# Altium schematic sheet 2014-09-02_06-17-421.schdoc
size 201 x 124 mm; SheetNumber: 1; SheetTotal: 1
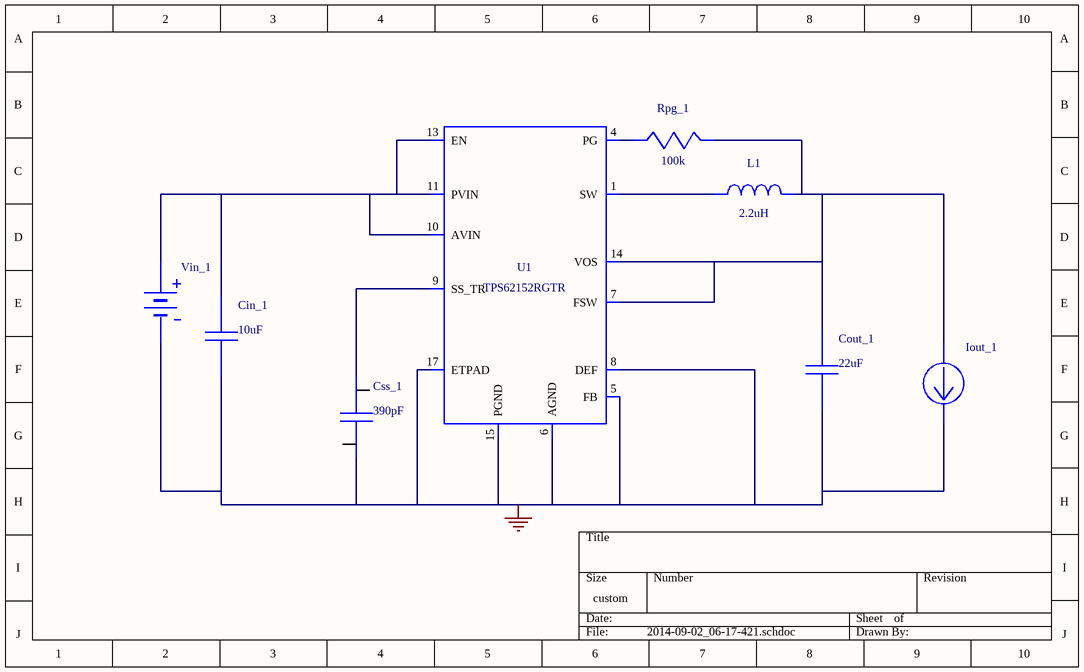
[diagram p0: 2014-09-02_06-17-421.schdoc]

## Parts
Cin_1  value 10uF  (hidden comment: CL10A106MQ8NNNC)
Cout_1  value 22uF  (hidden comment: C2012X5R0J226M)
Css_1  value 390pF  (hidden comment: GRM033R71C391KA01D)
Iout_1  WB_CURRENT_LOAD  (value not drawn)
L1  value 2.2uH  (hidden comment: SDR0403-2R2ML)
Rpg_1  value 100k  (hidden comment: CRCW0402100KFKED)
U1  TPS62131RGTR  (value not drawn)
Vin_1  WB_BATTERY  (value not drawn)

## Nets
0: Cin_1.2 Cout_1.2 Iout_1.2(-) U1.5(FB) U1.6(AGND) U1.8(DEF) U1.15(PGND) U1.16(PGND) U1.17(ETPAD) Vin_1.2(-)
NetCin_1_1: Cin_1.1 U1.10(AVIN) U1.11(PVIN) U1.12(PVIN) U1.13(EN) Vin_1.1(+)
NetCout_1_1: Cout_1.1 Iout_1.1(+) L1.1 Rpg_1.1 U1.7(FSW) U1.14(VOS)
NetL1_2: L1.2 U1.1(SW) U1.2(SW) U1.3(SW)
NetRpg_1_2: Rpg_1.2 U1.4(PG)

Not connected (* = marked no-connect by the designer): Css_1 1 2; U1 9(SS_TR)

## Library data of the parts
Cin_1 = CL10A106MQ8NNNC: Manufacturer Name: Samsung Electro-Mechanics; PackageReference: CL10A106MQ8NNNC; Manufacturer Part Number: CL10A106MQ8NNNC
Cout_1 = C2012X5R0J226M: Manufacturer Name: TDK; PackageReference: C2012X5R0J226M; Manufacturer Part Number: C2012X5R0J226M
Css_1 = GRM033R71C391KA01D: GRM033R71C391KA0; Manufacturer Name: MuRata; PackageReference: GRM033R71C391KA01D; Manufacturer Part Number: GRM033R71C391KA01D
Iout_1 = WB_CURRENT_LOAD: Value: UNLISTED; PackageReference: WB_CURRENT_LOAD; Manufacturer Part Number: WB_CURRENT_LOAD; Manufacturer Name: WB_CURRENT_LOAD
L1 = SDR0403-2R2ML: Manufacturer Name: Bourns; PackageReference: SDR0403-2R2ML; Manufacturer Part Number: SDR0403-2R2ML
Rpg_1 = CRCW0402100KFKED: Manufacturer Name: Vishay-Dale; PackageReference: CRCW0402100KFKED; Manufacturer Part Number: CRCW0402100KFKED
U1 = TPS62131RGTR: TPS62152RGTR; Manufacturer Name: Texas Instruments; Value: UNLISTED; PackageReference: TPS62152RGTR; Manufacturer Part Number: TPS62131RGTR
Vin_1 = WB_BATTERY: Value: UNLISTED; PackageReference: WB_BATTERY; Manufacturer Part Number: WB_BATTERY; Manufacturer Name: WB_BATTERY